# EAGLE design MicromotorBoard (EAGLE 9.6.0)
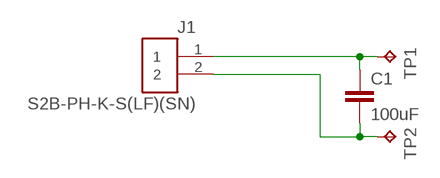
[diagram p0: schematic, sheet 1]

## Parts
C1  100uF  C-EUC0805K  [C0805K]
J1  S2B-PH-K-S(LF)(SN)  [S2B-PH-K-S(LF)(SN)]
TP1  TPPAD1-17Y  [P1-17Y]
TP2  TPPAD1-17Y  [P1-17Y]

## Nets
N$1: C1.1 J1.1 TP1.TP
N$2: C1.2 J1.2 TP2.TP

## Library data of the parts
C1 = rcl:C-EU: CAPACITOR, European symbol; SPICEPREFIX: C
J1 = Connectors:S2B-PH-K-S(LF)(SN): CONN HEADER R/A 2POS 2MM Manufacturer's datasheet <http://www.jst-mfg.com/product/pdf/eng/ePH.pdf>; CREATED_BY: PCBLayout.com; DIGI_KEY_PART_NUMBER: 455-1719-ND; MANUFACTURER: JST Sales America Inc.; MPN: S2B-PH-K-S(LF)(SN)
TP1 TP2 = testpad:TP: Test pad

## Board
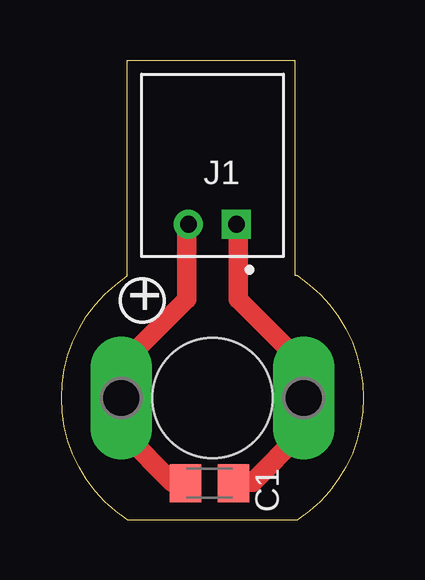
[diagram p1: board, top side]

Size 12.57 x 19.16 mm. Coordinates in mm from the lower left corner, seen from the top.
Outline: 2.73,0 9.84,0 arc113 9.84,10.16 9.71,10.16 9.71,19.16 2.73,19.16 2.73,10.16 arc113 2.73,0
Copper layers (1*16): Top 0.035mm / dielectric 1.5mm / Bottom 0.035mm
Design rules "default": minimum track width 6mil, minimum drill 0.35mm, track to track 6mil, track to pad 6mil, pad to pad 6mil, via to via 6mil, smd to smd 6mil, copper to edge 40mil, drill to drill 6mil, minimum pad ring 10mil, minimum via ring 8mil, stop-mask expansion 4mil, vias tented up to drill 0mil, thermal gap 10mil
Holes 5 mm at 6.29,5.08

### Footprints (pad centres in the part's own frame; a part is rotated, then mirrored left to right if it is on the bottom)
C0805K = smd 1.3 x 1.6: 1 -1,0; 2 1,0
S2B-PH-K-S(LF)(SN) = drill 0.7 square: 1 -1,0 | drill 0.7: 2 1,0
P1-17Y = drill 1.702 pad 2.121 long: TP 0,0

### Placement (x,y rotation side)
C1  6.16,1.52 180 top
J1  6.29,12.32 180 top
TP1  10.09,5.08 0 top
TP2  2.49,5.08 0 top

### Tracks (layer width: path | path; a pad name or v marks a point on that pad's centre or on a via)
N$1
  Top 0.152: 7.2,1.58 C1.1 | 7.35,12.24 J1.1 | 9.94,5.08 TP1.TP
  Top 0.813: 7.2,1.58 7.96,1.58 9.94,3.56 9.94,5.08 9.94,6.6 7.35,9.2 7.35,12.24
N$2
  Top 0.152: 4.61,1.58 5.07,1.58 | 5.22,12.24 J1.2 | 2.63,5.08 TP2.TP
  Top 0.813: 4.61,1.58 2.63,3.56 2.63,5.08 2.63,6.6 5.22,9.2 5.22,12.24 | 5.07,1.58 C1.2

### Text on the board
tNames: +
bNames: Micromotor / Board | palmacas.com